# Altium schematic sheet mixer.SchDoc
size A4
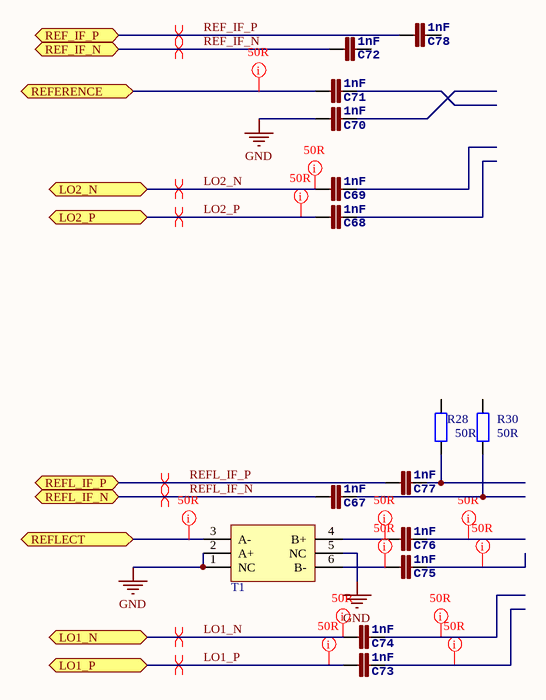
[diagram p0: mixer.SchDoc]

## Parts
C67  1nF  [0402]
C68  1nF  [0402]
C69  1nF  [0402]
C70  1nF  [0402]
C71  1nF  [0402]
C72  1nF  [0402]
C73  1nF  [0402]
C74  1nF  [0402]
C75  1nF  [0402]
C76  1nF  [0402]
C77  1nF  [0402]
C78  1nF  [0402]
R28  50R  [0402]
R30  50R  [0402]
T1  TCM1-63AX+  [TCM1-63AX+]  (value not drawn)

## Ports
LO1_N, LO1_P, LO2_N, LO2_P, REF_IF_N, REF_IF_P, REFERENCE, REFL_IF_N, REFL_IF_P, REFLECT

## Nets
GND: C70.1 T1.1(NC) T1.2(A+) T1.5(NC)
LO1_N: C74.1 ; port LO1_N
LO1_P: C73.1 ; port LO1_P
LO2_N: C69.1 ; port LO2_N
LO2_P: C68.1 ; port LO2_P
REF_IF_N: C72.1 ; port REF_IF_N
REF_IF_P: C78.1 ; port REF_IF_P
REFERENCE: C71.1 ; port REFERENCE
REFL_IF_N: C67.1 ; port REFL_IF_N
REFL_IF_P: C77.1 ; port REFL_IF_P
REFLECT: T1.3(A-) ; port REFLECT
NetC67_2: C67.2 R30.1
NetC75_1: C75.1 T1.6(B-)
NetC76_1: C76.1 T1.4(B+)
NetC77_2: C77.2 R28.1

Not connected (* = marked no-connect by the designer): C68 2; C69 2; C70 2; C71 2; C72 2; C73 2; C74 2; C75 2; C76 2; C78 2; R28 2; R30 2

## Layout directives
differential pair: LO1_N, LO1_P, LO2_N, LO2_P, REF_IF_N, REF_IF_P, REFL_IF_N, REFL_IF_P
net class 50R: LO1_N, LO1_P, LO2_N, LO2_P, NetC73_2, NetC74_2, NetC75_1, NetC75_2, NetC76_1, NetC76_2, REFERENCE, REFLECT

## Library data of the parts
C67-C78 = CAP0402-CAP: <b>Capacitor</b> / Standard 0603 ceramic capacitor, and 0.1" leaded capacitor.; PARTNO: CC0402ZRY5V7BB104
R28 R30 = Res2: Resistor; Published: 8-Jun-2000; LatestRevisionDate: 17-Jul-2002; LatestRevisionNote: Re-released for DXP Platform.; PackageReference: AXIAL-0.4; Publisher: Altium Limited; PackageDescription: Axial Device, Thru-Hole; 2 Leads; 0.4 in Pin Spacing